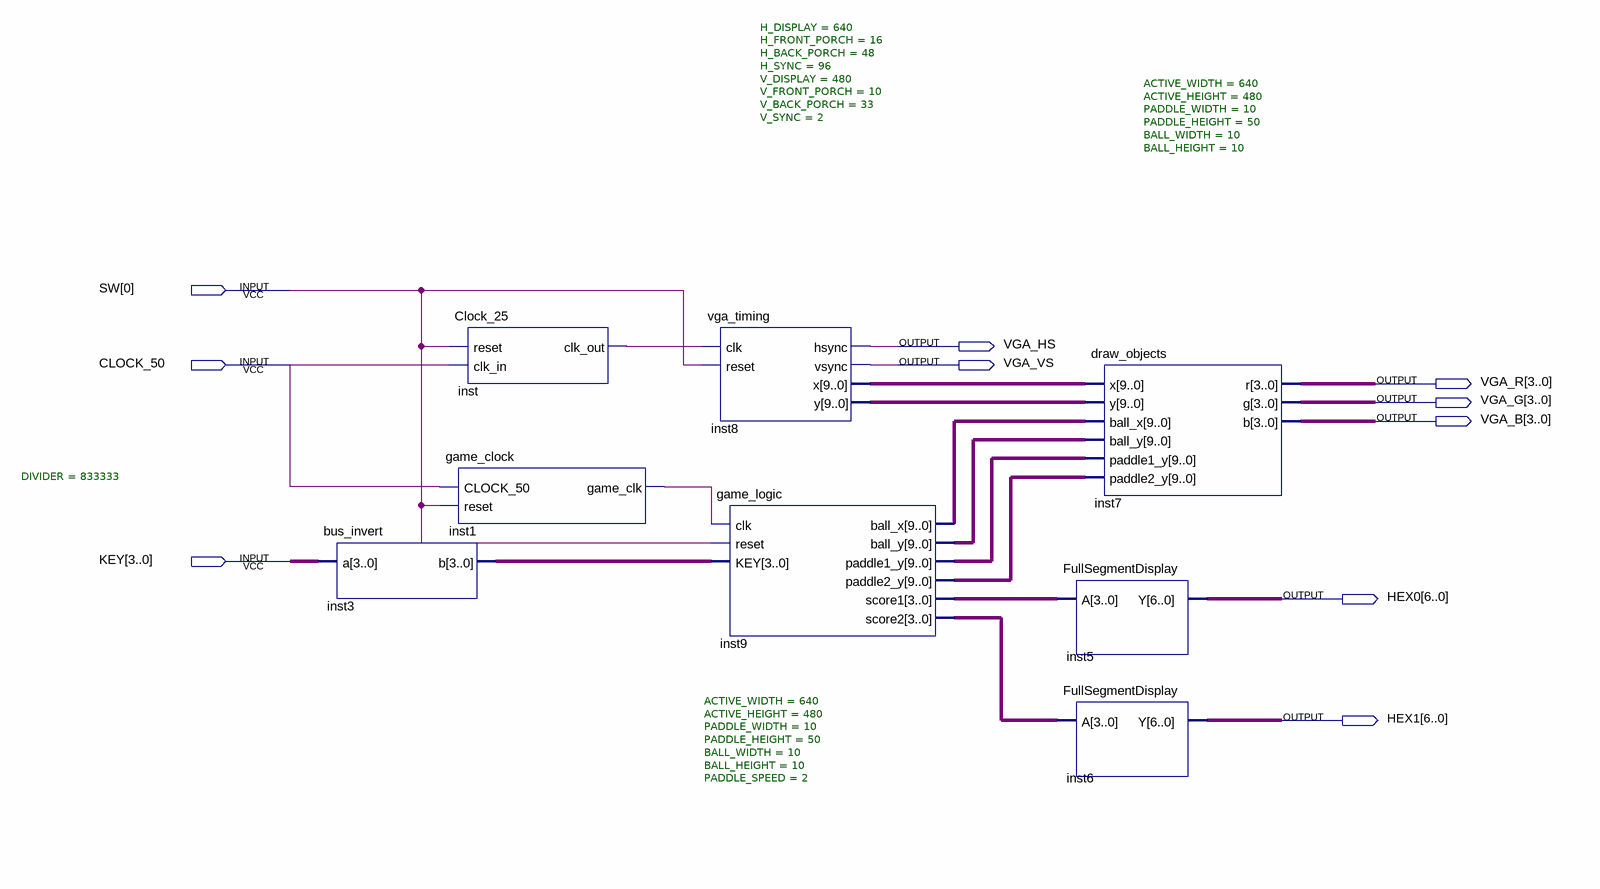
[diagram p0: schematic sheet]
// Quartus schematic vga_schematic.bdf as structural Verilog: 8 symbols, 10 pins
module vga_schematic (
  input  [0:0] SW,
  input  CLOCK_50,
  input  [3:0] KEY,
  output VGA_HS,
  output VGA_VS,
  output [3:0] VGA_R,
  output [3:0] VGA_G,
  output [3:0] VGA_B,
  output [6:0] HEX0,
  output [6:0] HEX1
);

  wire inst1_game_clk, inst_clk_out;
  wire [3:0] inst3_b, inst9_score1, inst9_score2;
  wire [9:0] inst8_x, inst8_y, inst9_ball_x, inst9_ball_y, inst9_paddle1_y, inst9_paddle2_y;

  bus_invert inst3 (.a(KEY), .b(inst3_b));
  Clock_25 inst (.reset(SW[0]), .clk_in(CLOCK_50), .clk_out(inst_clk_out));
  game_clock #(.DIVIDER(833333)) inst1 (.CLOCK_50(CLOCK_50), .reset(SW[0]), .game_clk(inst1_game_clk));
  vga_timing #(.H_DISPLAY(640), .H_FRONT_PORCH(16), .H_BACK_PORCH(48), .H_SYNC(96), .V_DISPLAY(480), .V_FRONT_PORCH(10), .V_BACK_PORCH(33), .V_SYNC(2)) inst8 (
    .clk(inst_clk_out), .reset(SW[0]), .hsync(VGA_HS), .vsync(VGA_VS), .x(inst8_x), .y(inst8_y));
  game_logic #(.ACTIVE_WIDTH(640), .ACTIVE_HEIGHT(480), .PADDLE_WIDTH(10), .PADDLE_HEIGHT(50), .BALL_WIDTH(10), .BALL_HEIGHT(10), .PADDLE_SPEED(2)) inst9 (
    .clk(inst1_game_clk), .reset(SW[0]), .KEY(inst3_b), .ball_x(inst9_ball_x), .ball_y(inst9_ball_y),
    .paddle1_y(inst9_paddle1_y), .paddle2_y(inst9_paddle2_y), .score1(inst9_score1), .score2(inst9_score2));
  draw_objects #(.ACTIVE_WIDTH(640), .ACTIVE_HEIGHT(480), .PADDLE_WIDTH(10), .PADDLE_HEIGHT(50), .BALL_WIDTH(10), .BALL_HEIGHT(10)) inst7 (
    .x(inst8_x), .y(inst8_y), .ball_x(inst9_ball_x), .ball_y(inst9_ball_y), .paddle1_y(inst9_paddle1_y),
    .paddle2_y(inst9_paddle2_y), .r(VGA_R), .g(VGA_G), .b(VGA_B));
  FullSegmentDisplay inst5 (.A(inst9_score1), .Y(HEX0));
  FullSegmentDisplay inst6 (.A(inst9_score2), .Y(HEX1));
endmodule
